# EAGLE schematic gordian-knot (EAGLE 9.3.2)
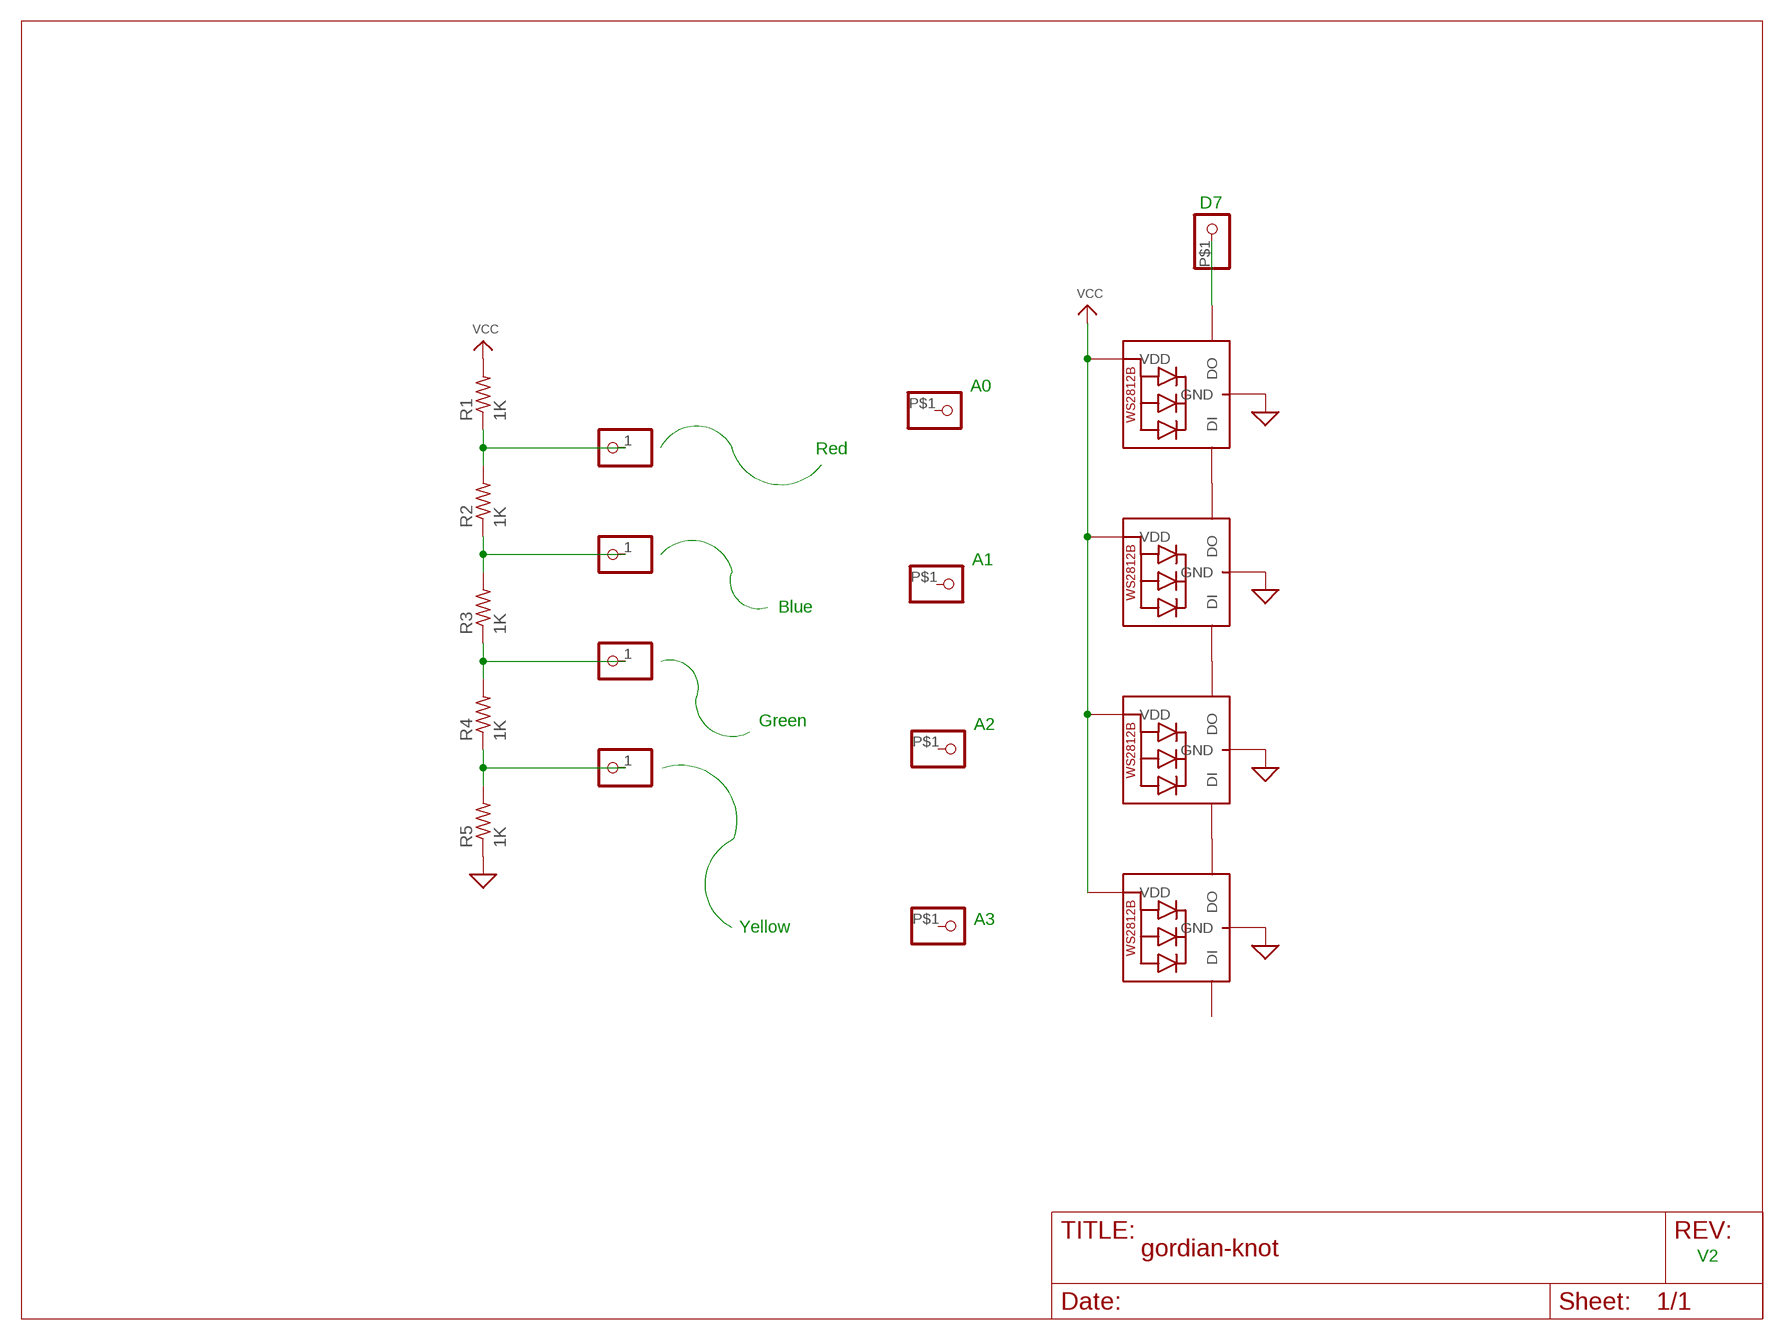
[diagram p0: schematic, sheet 1]

## Parts
JP1  PINHD-1X1-BIGPOGO  [1X1-BIGPOGO]
JP2  PINHD-1X1  [1X01]
JP3  PINHD-1X1-BIGPOGO  [1X1-BIGPOGO]
JP4  PINHD-1X1  [1X01]
JP5  PINHD-1X1-BIGPOGO  [1X1-BIGPOGO]
JP6  PINHD-1X1  [1X01]
JP7  PINHD-1X1-BIGPOGO  [1X1-BIGPOGO]
JP8  PINHD-1X1  [1X01]
JP10  PINHD-1X1-BIGPOGO  [1X1-BIGPOGO]
LED1  WS2812B5050  [WS2812B]
LED2  WS2812B5050  [WS2812B]
LED3  WS2812B5050  [WS2812B]
LED4  WS2812B5050  [WS2812B]
R1  1K  R-US_0207/9  [0207/9]
R2  1K  R-US_0207/9  [0207/9]
R3  1K  R-US_0207/9  [0207/9]
R4  1K  R-US_0207/9  [0207/9]
R5  1K  R-US_0207/9  [0207/9]

## Nets
GND: LED1.3-GND(GND) LED2.3-GND(GND) LED3.3-GND(GND) LED4.3-GND(GND) R5.1 ; supply symbol labelled SUP
N$1: JP2.1 R1.1 R2.2
N$2: JP4.1 R2.1 R3.2
N$3: JP6.1 R3.1 R4.2
N$4: JP8.1 R4.1 R5.2
N$9: LED1.4-DIN(DI) LED2.2-DOUT(DO)
N$10: LED2.4-DIN(DI) LED3.2-DOUT(DO)
N$11: LED3.4-DIN(DI) LED4.2-DOUT(DO)
N$12: JP10.P$1 LED1.2-DOUT(DO)
VCC: LED1.1-VDD(VDD) LED2.1-VDD(VDD) LED3.1-VDD(VDD) LED4.1-VDD(VDD) R1.2
Unconnected: JP1.P$1 JP3.P$1 JP5.P$1 JP7.P$1 LED4.4-DIN(DI)

## Notes on the sheet
- D7
- A0
- Red
- A1
- Blue
- Green | A2
- A3
- Yellow
- V2

## Library data of the parts
JP1-JP8 JP10 = adafruit:PINHD-1X1: Pin header 1x1 for 0.1" spacing With round pins
LED1-LED4 = adafruit:WS2812B
R1-R5 = adafruit:R-US_: RESISTOR, American symbol